# EAGLE design IEEE_EXT_Riser (EAGLE 9.5.2)
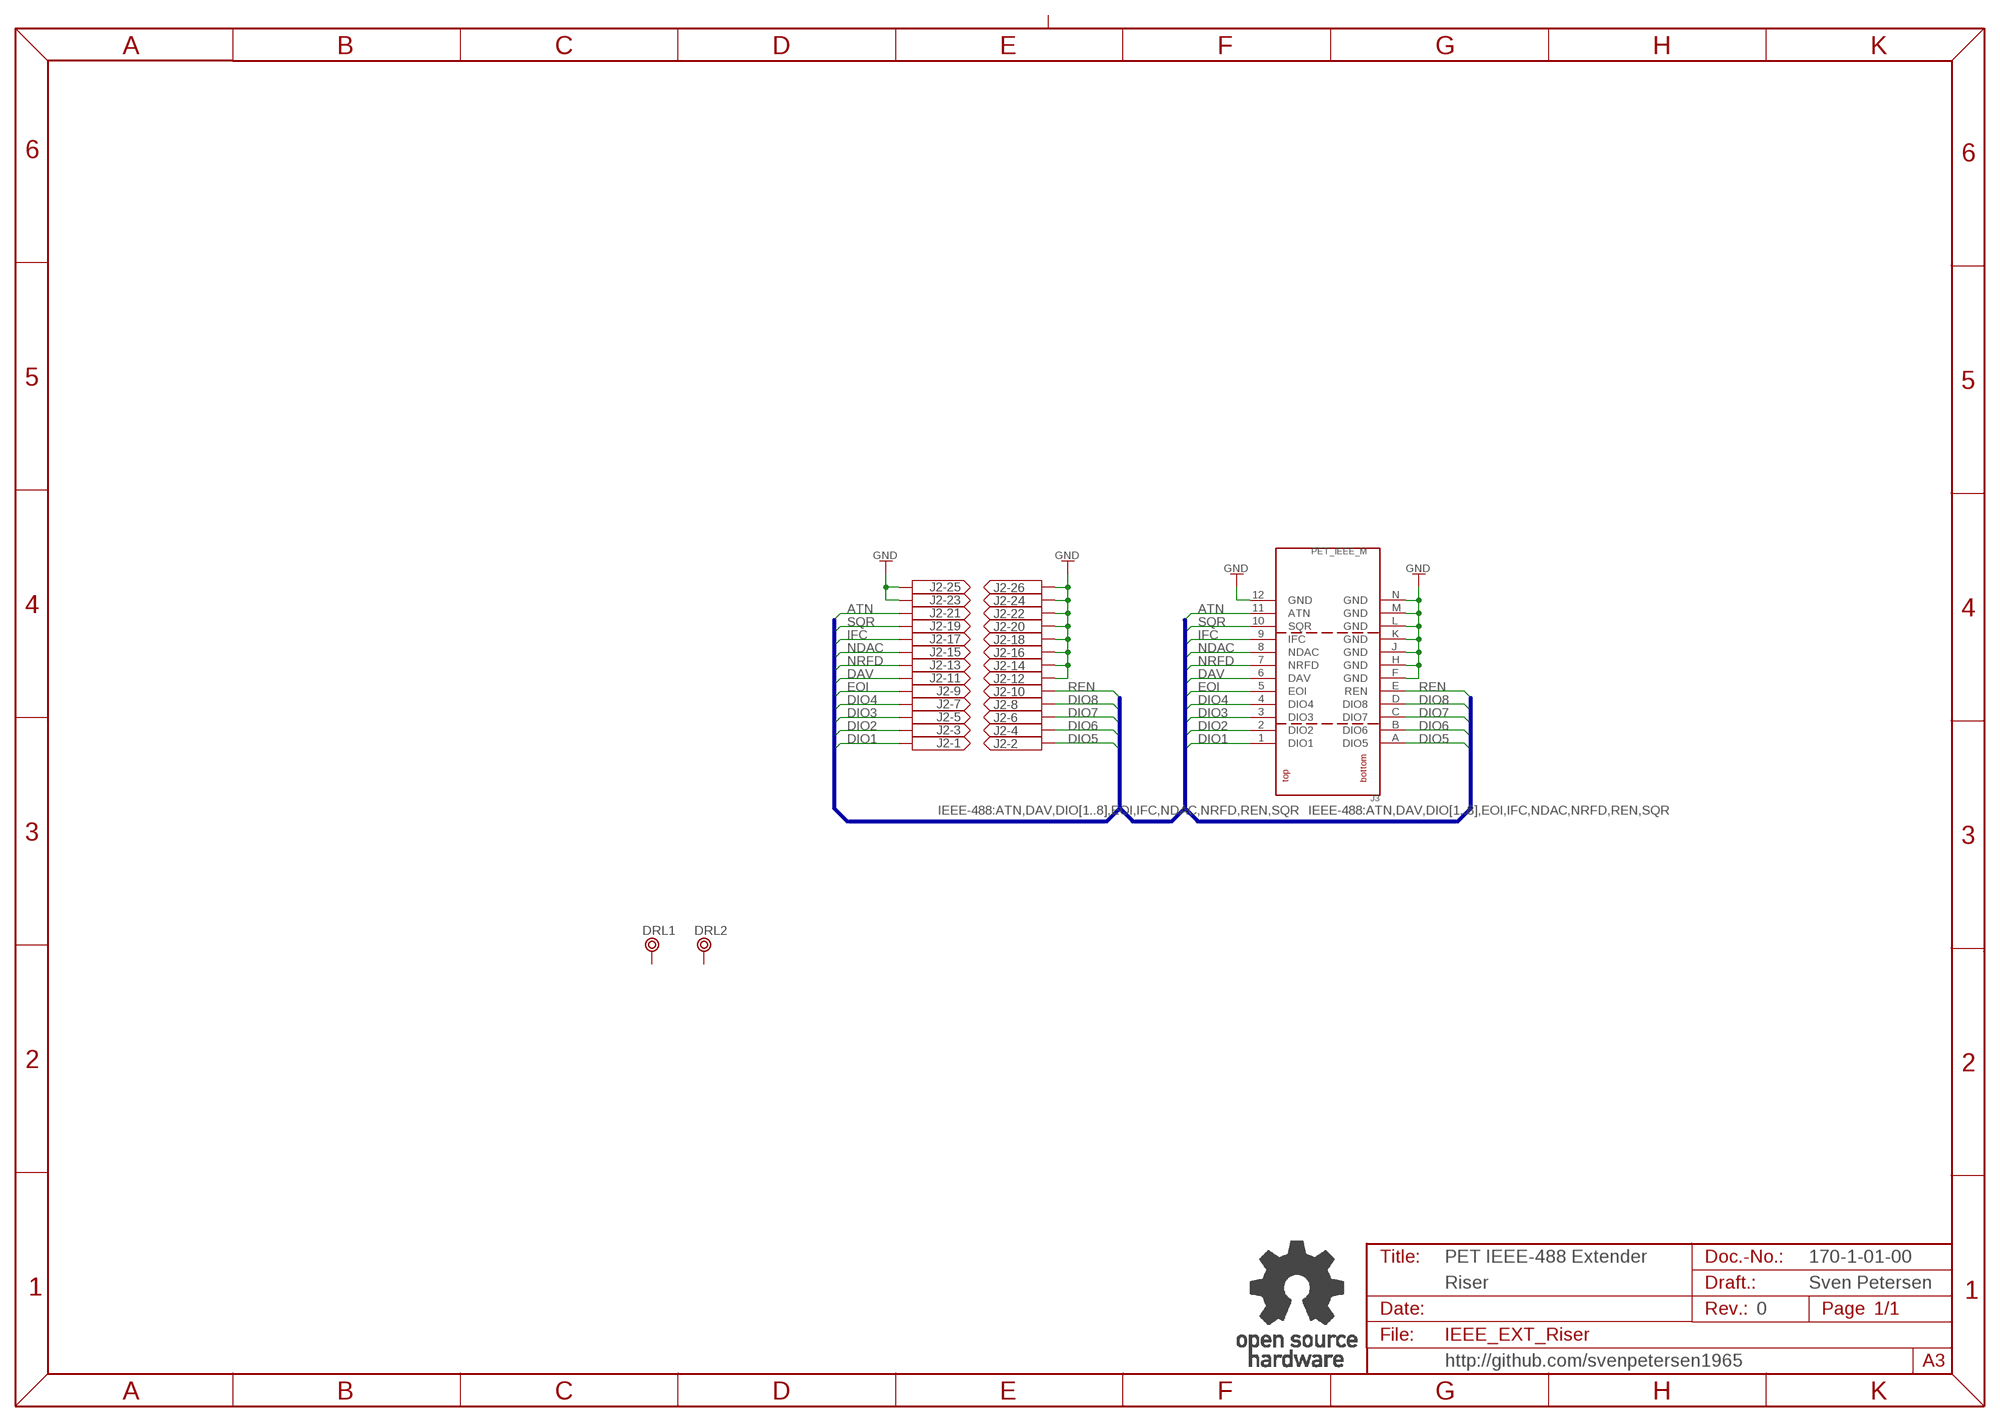
[diagram p0: schematic, sheet 1]

## Parts
DRL1  BOHR3,5  [BOHR3,5]
DRL2  BOHR3,5  [BOHR3,5]
J2  2X13WANNE  [2X13WV]
J3  PET_IEEE_M  [PET_IEEE_M]
U$9  OPEN_SOURCE_HW  [OPENHW]

## Nets
ATN: J2.21 J3.11(ATN)
DAV: J2.11 J3.6(DAV)
DIO1: J2.1 J3.1(DIO1)
DIO2: J2.3 J3.2(DIO2)
DIO3: J2.5 J3.3(DIO3)
DIO4: J2.7 J3.4(DIO4)
DIO5: J2.2 J3.A(DIO5)
DIO6: J2.4 J3.B(DIO6)
DIO7: J2.6 J3.C(DIO7)
DIO8: J2.8 J3.D(DIO8)
EOI: J2.9 J3.5(EOI)
GND: J2.12 J2.14 J2.16 J2.18 J2.20 J2.22 J2.23 J2.24 J2.25 J2.26 J3.12(GND) J3.F(GND) J3.H(GND) J3.J(GND) J3.K(GND) J3.L(GND) J3.M(GND) J3.N(GND)
IFC: J2.17 J3.9(IFC)
NDAC: J2.15 J3.8(NDAC)
NRFD: J2.13 J3.7(NRFD)
REN: J2.10 J3.E(REN)
SQR: J2.19 J3.10(SQR)
Unconnected: DRL1.P$1 DRL2.P$1

## Buses
IEEE-488:ATN,DAV,DIO[1..8],EOI,IFC,NDAC,NRFD,REN,SQR

## Notes on the sheet
- PET IEEE-488 Extender | 170-1-01-00
- Riser | Sven Petersen
- 0
- http://github.com/svenpetersen1965

## Library data of the parts
DRL1 DRL2 = Mech_Bohr:BOHR3,5
J2 = PINHEAD:2X13WANNE
J3 = Commodore:PET_IEEE
U$9 = Logo:OPEN_SOURCE_HW

## Board
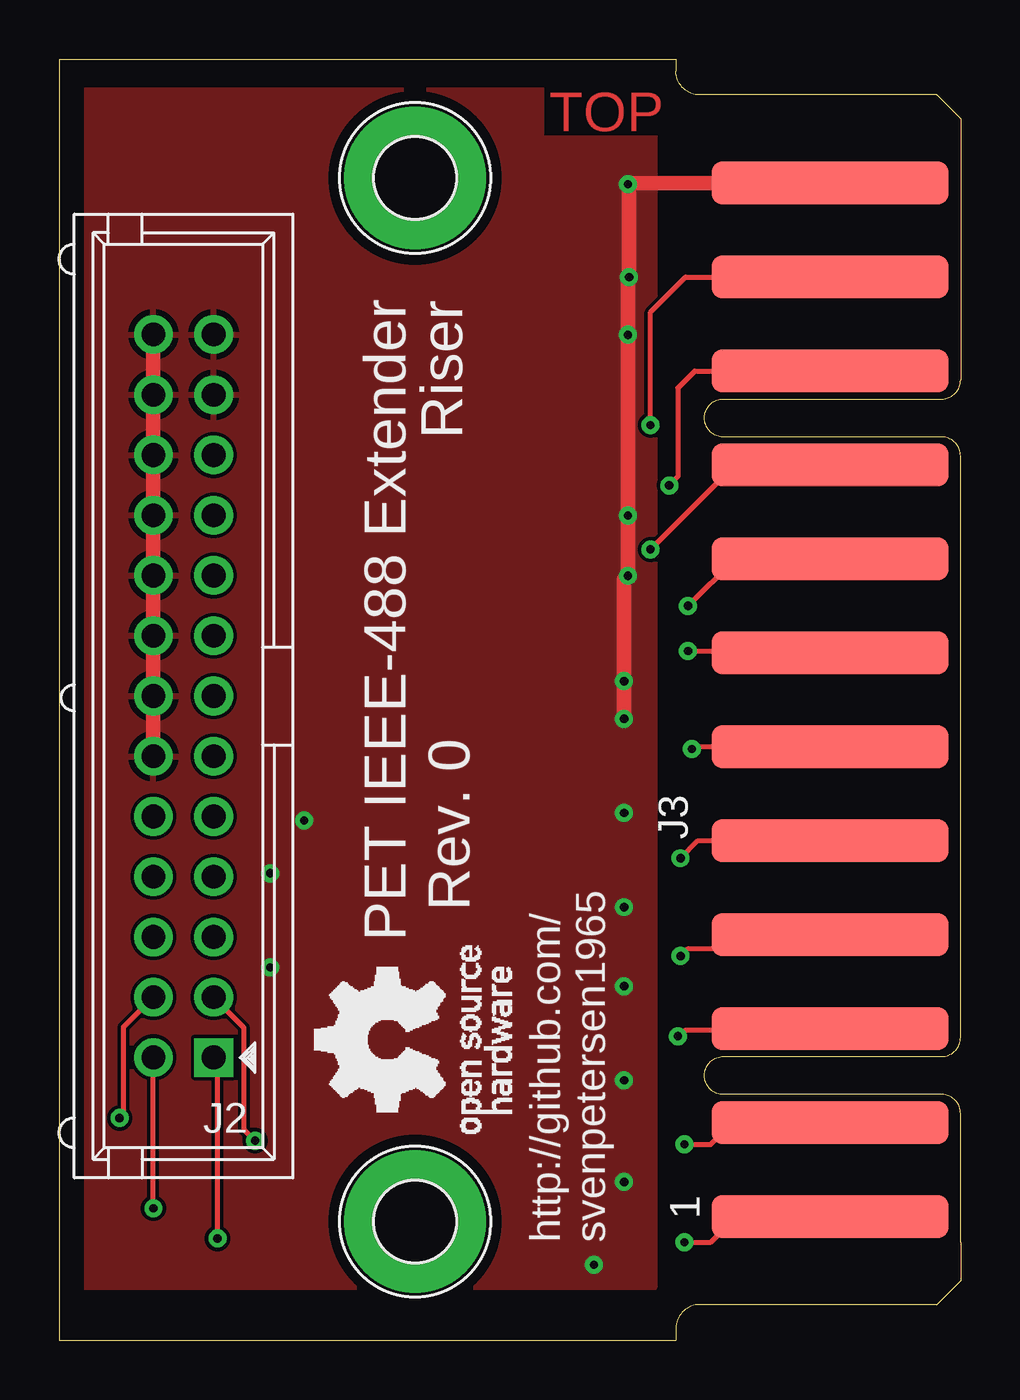
[diagram p1: board, top side]
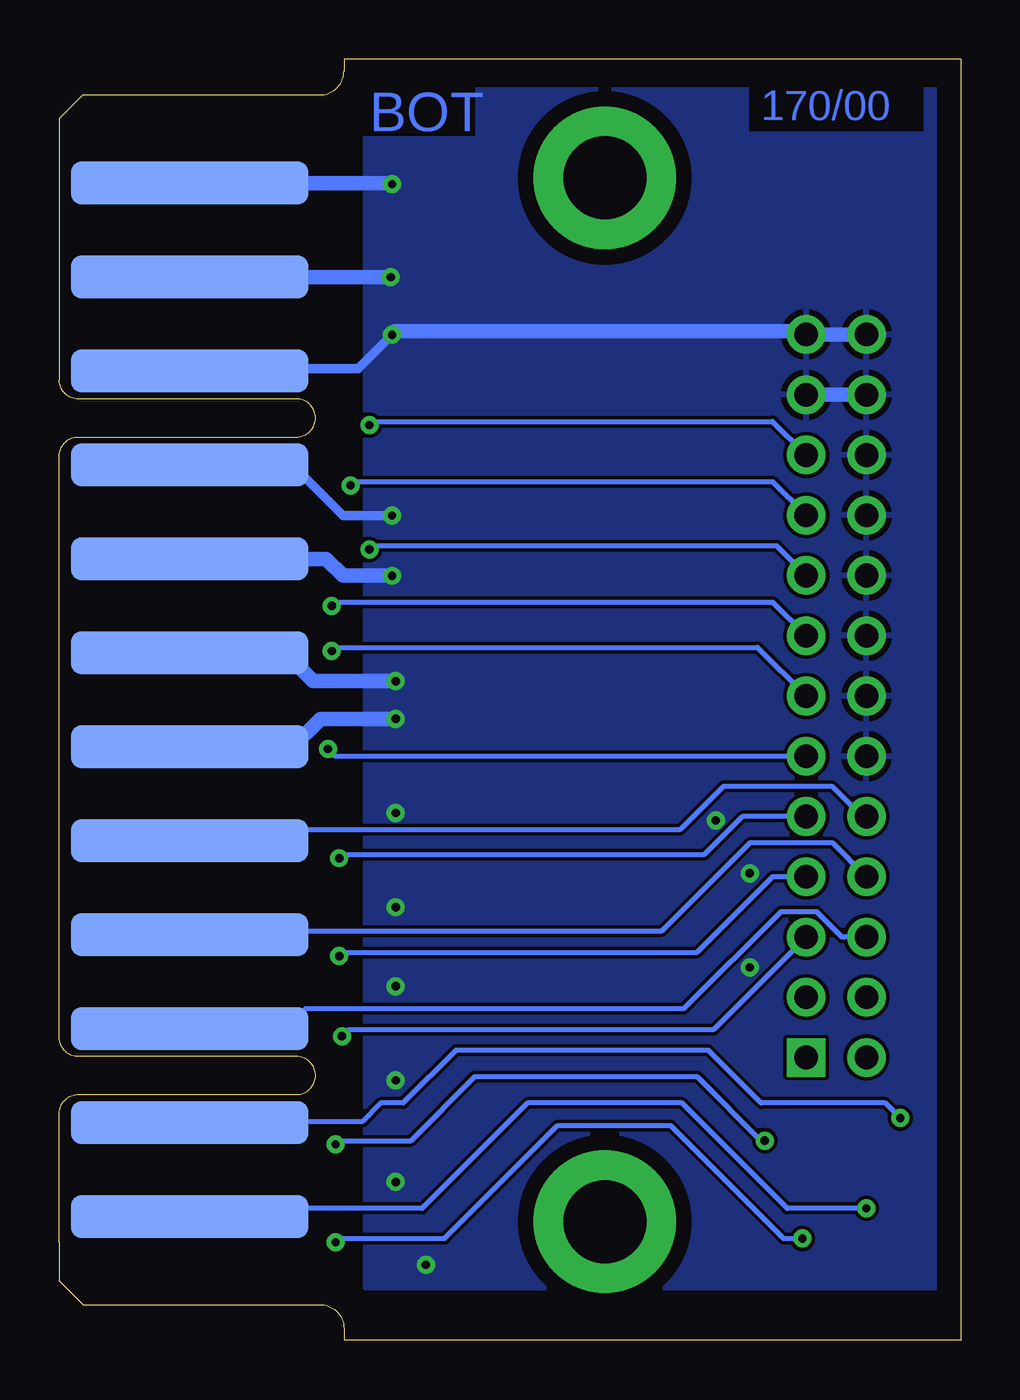
[diagram p2: board, bottom side, seen from below]

Size 38 x 54 mm. Coordinates in mm from the lower left corner, seen from the top.
Outline: 26,53.5 26,54 0,54 0,0 26,0 26,0.5
Copper layers (1*16): Top 0.035mm / dielectric 1.5mm / Bottom 0.035mm
Design rules "default *": minimum track width 6mil, minimum drill 0.35mm, track to track 6mil, track to pad 6mil, pad to pad 6mil, via to via 6mil, smd to smd 6mil, copper to edge 40mil, drill to drill 6mil, minimum pad ring 10mil, minimum via ring 8mil, stop-mask expansion 4mil, vias tented up to drill 25mil, thermal gap 10mil
bRestrict: 3 lines

### Footprints (pad centres in the part's own frame; a part is rotated, then mirrored left to right if it is on the bottom)
BOHR3,5 = drill 3.5 pad 6: P$1 0,0
2X13WV = drill 1 pad 1.626 square: 1 -15.24,-1.27 | drill 1 pad 1.626: 2 -15.24,1.27; 3 -12.7,-1.27; 4 -12.7,1.27; 5 -10.16,-1.27; 6 -10.16,1.27; 7 -7.62,-1.27; 8 -7.62,1.27; 9 -5.08,-1.27; 10 -5.08,1.27; 11 -2.54,-1.27; 12 -2.54,1.27; 13 0,-1.27; 14 0,1.27; 15 2.54,-1.27; 16 2.54,1.27; 17 5.08,-1.27; 18 5.08,1.27; 19 7.62,-1.27; 20 7.62,1.27; 21 10.16,-1.27; 22 10.16,1.27; 23 12.7,-1.27; 24 12.7,1.27; 25 15.24,-1.27; 26 15.24,1.27
PET_IEEE_M = smd 1.8 x 10: 1 -21.78,5.5; 2 -17.82,5.5; 3 -13.86,5.5; 4 -9.9,5.5; 5 -5.94,5.5; 6 -1.98,5.5; 7 1.98,5.5; 8 5.94,5.5; 9 9.9,5.5; 10 13.86,5.5; 11 17.82,5.5; 12 21.78,5.5 | smd 1.8 x 10 bottom: A -21.78,5.5; B -17.82,5.5; C -13.86,5.5; D -9.9,5.5; E -5.94,5.5; F -1.98,5.5; H 1.98,5.5; J 5.94,5.5; K 9.9,5.5; L 13.86,5.5; M 17.82,5.5; N 21.78,5.5

### Placement (x,y rotation side)
DRL1  15,5 0 top
DRL2  15,49 0 top
J2  5.24,27.16 90 top
J3  38,27 90 top
U$8  [PCB-TITLE/]  0,68.42 0 top  (outside the outline)
U$9  19.05,8.73 90 top
U$10  [2LAYER]  20.64,50.96 0 top

### Tracks (layer width: path | path; a pad name or v marks a point on that pad's centre or on a via)
ATN  (via drill 0.35)
  Top 0.203: v24.93,38.58 24.93,43.34 26.41,44.82 J3.11
  Bottom 0.203: J2.21 7.92,38.73 24.77,38.73 v24.93,38.58
DAV  (via drill 0.35)
  Top 0.203: v26.67,24.92 26.77,25.02 J3.6
  Bottom 0.203: J2.11 26.37,24.62 v26.67,24.92
DIO1  (via drill 0.35)
  Top 0.203: v26.35,4.13 27.46,4.13 28.56,5.22 J3.1 | v6.67,4.29 6.67,11.76 J2.1
  Bottom 0.203: v26.35,4.13 26.2,4.29 21.75,4.29 16.99,9.05 12.22,9.05 7.46,4.29 v6.67,4.29
DIO2  (via drill 0.35)
  Top 0.203: v8.26,8.41 7.78,8.89 7.78,13.19 J2.3 | v26.35,8.26 27.46,8.26 28.39,9.18 J3.2
  Bottom 0.203: v26.35,8.26 26.2,8.41 23.18,8.41 20.48,11.11 11.11,11.11 8.41,8.41 v8.26,8.41
DIO3  (via drill 0.35)
  Top 0.203: J3.3 32.44,13.08 26.42,13.08 26.16,12.81 v26.08,12.81
  Bottom 0.203: J2.5 10.16,13.35 10.16,13.34 10.4,13.09 25.8,13.09 v26.08,12.81
DIO4  (via drill 0.35)
  Top 0.203: v26.2,16.19 26.51,16.51 32.23,16.51 32.5,16.78 J3.4
  Bottom 0.203: J2.7 7.93,19.54 11.11,16.35 26.04,16.35 v26.2,16.19
DIO5  (via drill 0.35)
  Top 0.203: v3.97,5.56 J2.2
  Bottom 0.203: v3.97,5.56 7.3,5.56 11.75,10 18.26,10 22.7,5.56 32.16,5.56 J3.A
DIO6  (via drill 0.35)
  Top 0.203: v2.54,9.37 2.7,9.53 2.7,13.19 J2.4
  Bottom 0.203: v2.54,9.37 3.18,10 8.41,10 10.64,12.22 21.27,12.22 23.5,10 24.45,10 25.24,9.21 32.47,9.21 J3.B
DIO7
  Bottom 0.203: J2.6 4.91,17 4.92,16.99 4.99,16.99 6.07,18.07 7.58,18.07 11.68,13.97 27.62,13.97 28.45,13.14 J3.C
DIO8
  Bottom 0.203: J2.8 5.38,20.95 8.89,20.95 12.59,17.26 32.34,17.26 J3.D
EOI  (via drill 0.35)
  Top 0.203: v26.2,20.32 26.93,21.06 J3.5
  Bottom 0.203: J2.9 9.2,22.08 10.8,20.48 26.04,20.48 v26.2,20.32
GND  (via drill 0.35)
  Top 0.61: J2.12 J2.14 J2.16 J2.18 J2.20 J2.22 J2.24 J2.26 | J3.N 24.02,48.78 | 24.02,48.78 v23.97,48.74 | v23.81,26.19 v23.81,27.78 23.81,32.07 v23.97,32.23 v23.97,34.77 v23.97,42.39 23.97,44.77 v24.02,44.82 v24.02,44.83 24.02,48.78
  Bottom 0.406: J3.F 28.99,25.02 28.89,24.92 28.26,24.92 | J3.K 28.17,36.9 26.04,34.77 v23.97,34.77 | J3.L 32.4,40.96 25.4,40.96 v23.97,42.39 | v24.02,44.82 23.97,44.77
  Bottom 0.61: v23.81,26.19 26.99,26.19 28.26,24.92 | J2.24 J2.23 | J2.26 J2.25 6.65,42.55 23.81,42.55 v23.97,42.39 | J3.H 28.65,28.98 28.58,29.05 27.31,27.78 v23.81,27.78 | J3.J 26.75,32.94 26.04,32.23 v23.97,32.23 | J3.M v24.02,44.82 | J3.N 24.02,48.78 v23.97,48.74
  other vias: 23.81,22.23 23.81,18.26 23.81,14.92 23.81,10.95 23.81,6.67 22.54,3.17 8.89,15.72 8.89,19.68 10.32,21.91
  pour Top: 0.64,52.7 25.08,52.7 25.08,2.22 0.64,2.22
  pour Bottom: 0.64,52.7 25.08,52.7 25.08,2.22 0.64,2.22
IFC  (via drill 0.35)
  Top 0.203: v24.93,33.34 28.49,36.9 J3.9
  Bottom 0.203: J2.17 7.76,33.5 24.77,33.5 v24.93,33.34
NDAC  (via drill 0.35)
  Top 0.203: v26.51,30.96 28.5,32.94 J3.8
  Bottom 0.203: J2.15 7.92,31.11 26.35,31.11 v26.51,30.96
NRFD  (via drill 0.35)
  Top 0.203: v26.51,29.05 32.43,29.05 J3.7
  Bottom 0.203: J2.13 8.56,29.21 26.35,29.21 v26.51,29.05
REN
  Bottom 0.203: J2.10 4.14,22.08 5.4,23.34 10,23.34 11.8,21.54 32.02,21.54 J3.E
SQR  (via drill 0.35)
  Top 0.203: v25.72,36.04 26.08,36.4 26.08,40.14 26.8,40.86 J3.10
  Bottom 0.203: J2.19 7.92,36.2 25.56,36.2 v25.72,36.04

### Text on the board
Bottom: 170/00
tPlace: Riser | Rev. 0 | PET IEEE-488 Extender | http://github.com/ / svenpetersen1965
Document: 170-2-01-00 | Sven Petersen / 2020 | 35µm | 2 | 0